# Altium schematic sheet Sheet-new.SchDoc
size A; SheetNumber: 1; SheetTotal: 1
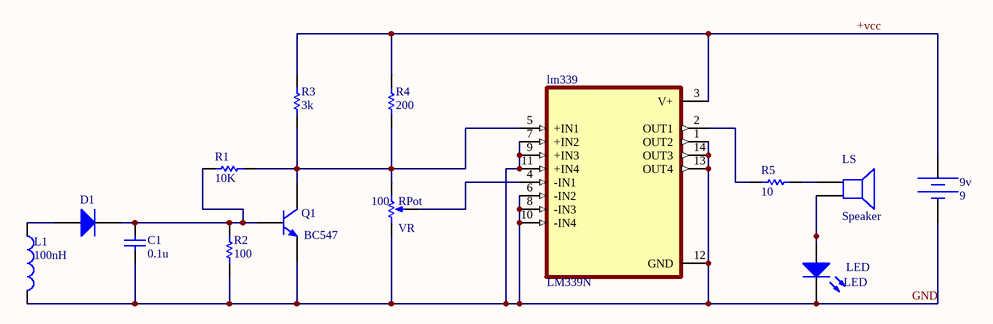
[diagram p0: Sheet-new.SchDoc]

## Parts
9v  DC Magnitude: 9  [MHDR1X2]  (hidden comment: Constant Voltage Source)
C1  value 0.1u  [CAPR5-4X5]  (hidden comment: Capacitor)
D1  Diode  [DIODE-0.4]  (value not drawn)
L1  L1: 100nH  [HDR1X2]  (hidden comment: Inductor)
LED  LED  [HDR1X2]
lm339  LM339N  [DIP794W45P254L1969H508Q14]
LS  Speaker  [PIN2]
Q1  BC547  [TO92]
R1  value 10K  [AXIAL-0.4]  (hidden comment: Resistor)
R2  value 100  [AXIAL-0.4]  (hidden comment: Resistor)
R3  value 3k  [AXIAL-0.4]  (hidden comment: Resistor)
R4  value 200  [AXIAL-0.4]  (hidden comment: Resistor)
R5  value 10  [AXIAL-0.4]  (hidden comment: Resistor)
VR  RPot  value 100  [VR4]

## Nets
+vcc: 9v.1 lm339.3(V+) R3.1 R4.1
GND: 9v.2 C1.1 L1.2 LED.2(K) lm339.1(OUT2) lm339.6(-IN2) lm339.7(+IN2) lm339.8(-IN3) lm339.9(+IN3) lm339.10(-IN4) lm339.11(+IN4) lm339.12(GND) lm339.13(OUT4) lm339.14(OUT3) Q1.3(E) R2.2 VR.1(TOP)
NetC1_2: C1.2 D1.2(K) Q1.2(B) R1.1 R2.1
NetD1_1: D1.1(A) L1.1
NetLED_1: LED.1(A) LS.2
Netlm339_2: lm339.2(OUT1) R5.1
Netlm339_4: lm339.4(-IN1) VR.3(TAP)
Netlm339_5: lm339.5(+IN1) Q1.1(C) R1.2 R3.2 R4.2 VR.2(BOT)
NetLS_1: LS.1 R5.2

## Library data of the parts
9v = Battery: SimulationGenericComponent: True
C1 = Capacitor: SimulationGenericComponent: True
D1 = Diode: AF: 1; BV: 0; BV_MAX: 1e99; EG: 1.11; FC: 0.5; IBV: 0.001; ISR: 1e-14; MJSW: 0.33; NTUN: 30; TNOM: 27; XTI: 3; SimulationGenericComponent: True; CJO: 0; CJP: 0; CTA: 0; CTP: 0; FCS: 0.5; FV_MAX: 1e99; IKF: 0; IKR: 0; JSW: 0; JTUN: 0; JTUNSW: 0; KEG: 1; KF: 0; LEVEL: 1; N: 1; NBV: 1; NR: 1; NS: 1; PHP: 1; RS: 0; TCV: 0; TLEV: 0; TLEVC: 0; TM1: 0; TM2: 0; TPB: 0; TPHP: 0; TRS: 0; TRS2: 0; TT: 0; TTT1: 0; TTT2: 0; VJ: 1; XTITUN: 3; IS: 1e-14
L1 = Inductor: SimulationGenericComponent: True
LED = LED: Light-Emitting Diode; AF: 1; BV: 0; BV_MAX: 1e99; EG: 1.11; FC: 0.5; IBV: 0.001; IS: 1e-14; MJSW: 0.33; NTUN: 30; TNOM: 27; XTI: 3; SimulationGenericComponent: True; CJO: 0; CJP: 0; CTA: 0; CTP: 0; FCS: 0.5; FV_MAX: 1e99; IKF: 0; IKR: 0; ISR: 1e-14; JSW: 0; JTUN: 0; JTUNSW: 0; KEG: 1; KF: 0; LEVEL: 1; N: 1; NBV: 1; NR: 1; NS: 1; PHP: 1; RS: 0; TCV: 0; TLEV: 0; TLEVC: 0; TM1: 0; TM2: 0; TPB: 0; TPHP: 0; TRS: 0; TRS2: 0; TT: 0; TTT1: 0; TTT2: 0; VJ: 1; XTITUN: 3
LS = Speaker: Loudspeaker; Published: 24-Mar-1999; LatestRevisionDate: 17-Jul-2002; LatestRevisionNote: Re-released for DXP Platform.; PackageReference: PIN2; Publisher: Altium Limited
Q1 = BJT NPN_MGP: Bipolar NPN 3 Pins Transistor Modified Version of the Gummel-Poon Model; BF: 100; AF: 0; BR: 1; EG: 1.11; FC: 0.5; IS: 1e-16; MJC: 0.33; NC: 2; NE: 1.5; TNOM: 27; VBC_MAX: 1e99; VJC: 0.75; XTI: 3; SimulationGenericComponent: True; CJC: 0; CJE: 0; CJS: 0; CTC: 0; CTE: 0; CTS: 0; IKF: 0; IKR: 0; IRB: 0; ISC: 0; ISE: 0; ISS: 0; ITF: 0; KF: 0; MJE: 0.33; MJS: 0; NF: 1; NKF: 0.5; NR: 1; NS: 1; PTF: 0; RB: 0; RBM: 0; RC: 0; RE: 0; SUBS: 1; TBF1: 0; TBF2: 0; TBR1: 0; TBR2: 0; TF: 0; TIKF1: 0; TIKF2: 0; TIKR1: 0; TIKR2: 0; TIRB1: 0; TIRB2: 0; TIS1: 0; TIS2: 0; TISC1: 0; TISC2: 0; TISE1: 0; TISE2: 0; TITF1: 0; TITF2: 0; TLEV: 0; TLEVC: 0; TMJC1: 0; TMJC2: 0; TMJE1: 0; TMJE2: 0; TMJS1: 0; TMJS2: 0; TNC1: 0; TNC2: 0; TNE1: 0; TNE2: 0; TNF1: 0; TNF2: 0; TNR1: 0; TNR2: 0; TNS1: 0; TNS2: 0; TR: 0; TRB1: 0; TRB2: 0; TRC1: 0; TRC2: 0; TRE1: 0; TRE2: 0; TRM1: 0; TRM2: 0; TTF1: 0; TTF2: 0; TTR1: 0; TTR2: 0; TVAF1: 0; TVAF2: 0; TVAR1: 0; TVAR2: 0; TVJC: 0; TVJE: 0; TVJS: 0; VAF: 0; VAR: 0; VBE_MAX: 1e99; VCE_MAX: 1e99; VJE: 0.75; VJS: 0.75; VTF: 0; XCJC: 1; XTB: 0; XTF: 0
R1-R5 = Resistor: TC1: 0; SimulationGenericComponent: True; TC2: 0
VR = RPot: Potentiometer; Sim Note: Enter the Resistance value and the set point into parameter fields.; Set Position: 0.5; Published: 8-Jun-2000; LatestRevisionDate: 17-Jul-2002; LatestRevisionNote: Re-released for DXP Platform.; PackageReference: VR5; Publisher: Altium Limited; PackageDescription: Variable Resistor, Thru-Hole; 3 Leads
lm339 = LM339N: Price: None; Value: *; Package: None; Availability: Unavailable; MP: LM339N